# Altium schematic sheet SH27 - EXPANSION1.SchDoc
size 386 x 246 mm
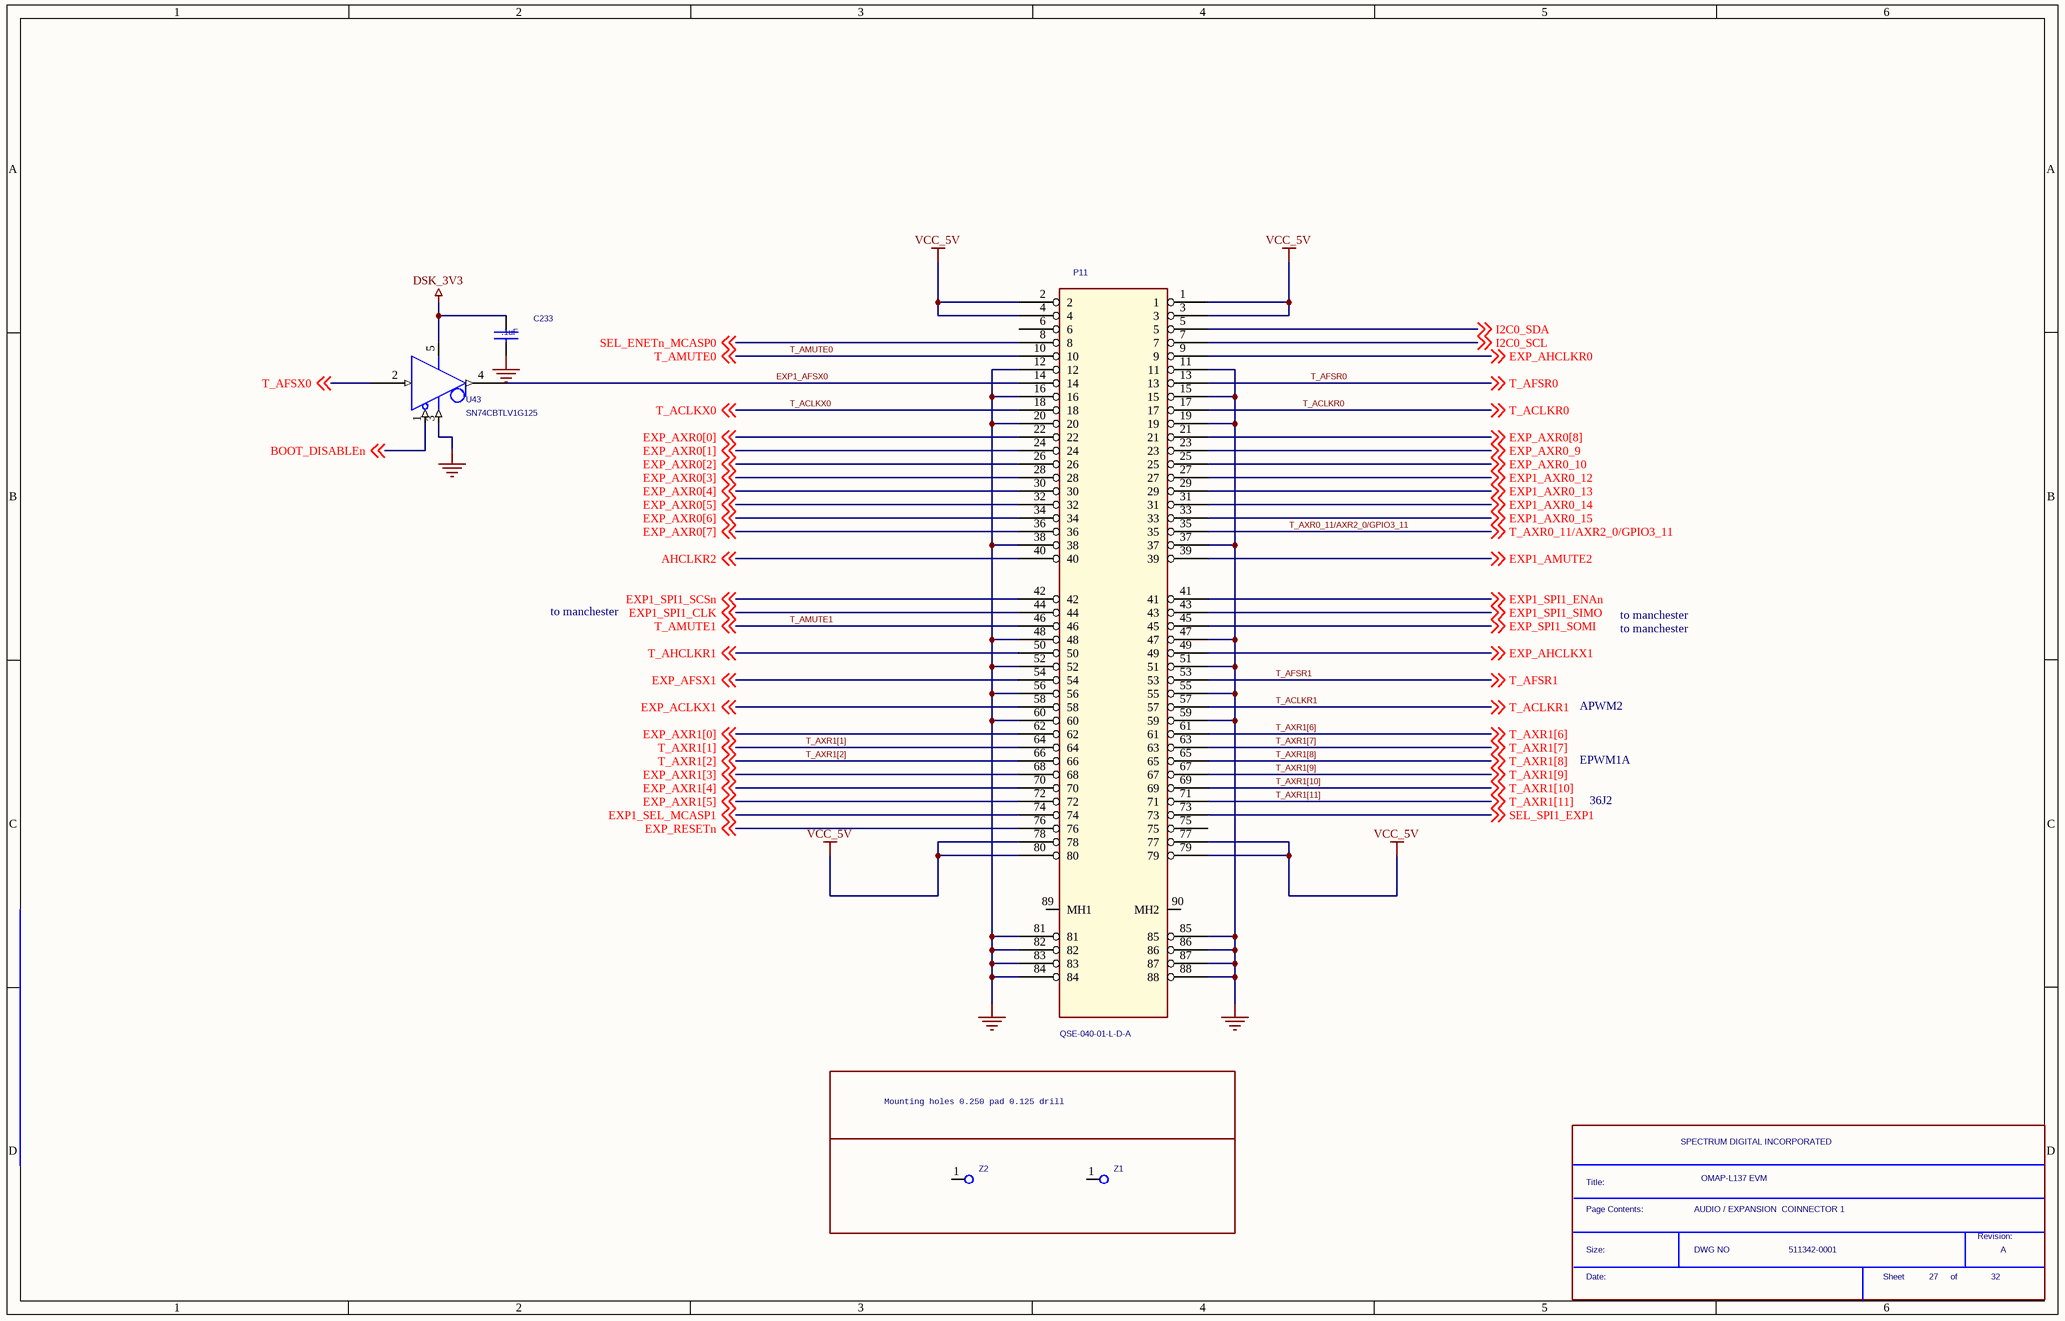
[diagram p0: SH27 - EXPANSION1.SchDoc]

## Parts
*  Page Contents:: AUDIO / EXPANSION  COINNECTOR 1  RevCode: A  Title: OMAP-L137 EVM  OrgName: SPECTRUM DIGITAL INCORPORATED  Doc: 511342-0001  Page Number: 27  Page Count: 32  (hidden comment: SDTitleBlock)  (graphical)
C233  .1uF  [c402-25]
P11  QSE-040-01-L-D-A  [qse_040]
U43  SN74CBTLV1G125  [DCK]
Z1  TestPoint1  [TP1_0-2_0]  (value not drawn)
Z2  MNTHOLE  [TP1_0-2_0]  (value not drawn)

## Blocks framed on the sheet
Mounting holes 0.250 pad 0.125 drill: Z1 Z2

## Nets
DSK_3V3: C233.1 U43.5(VCC)
GND: C233.2 P11.11 P11.12 P11.15 P11.16 P11.19 P11.20 P11.37 P11.38 P11.47 P11.48 P11.51 P11.52 P11.55 P11.56 P11.59 P11.60 P11.81 P11.82 P11.83 P11.84 P11.85 P11.86 P11.87 P11.88 U43.3(GND)
VCC_5V: P11.1 P11.2 P11.3 P11.4 P11.77 P11.78 P11.79 P11.80
AHCLKR2: P11.40 ; off-sheet AHCLKR2
BOOT_DISABLEn: U43.1(OE) ; off-sheet BOOT_DISABLEn
EXP1_AFSX0: P11.14 U43.4(O)
EXP1_AMUTE2: P11.39 ; off-sheet EXP1_AMUTE2
EXP1_AXR0_12: P11.27 ; off-sheet EXP1_AXR0_12
EXP1_AXR0_13: P11.29 ; off-sheet EXP1_AXR0_13
EXP1_AXR0_14: P11.31 ; off-sheet EXP1_AXR0_14
EXP1_AXR0_15: P11.33 ; off-sheet EXP1_AXR0_15
EXP1_SEL_MCASP1: P11.74 ; off-sheet EXP1_SEL_MCASP1
EXP1_SPI1_CLK: P11.44 ; off-sheet EXP1_SPI1_CLK
EXP1_SPI1_ENAn: P11.41 ; off-sheet EXP1_SPI1_ENAn
EXP1_SPI1_SCSn: P11.42 ; off-sheet EXP1_SPI1_SCSn
EXP1_SPI1_SIMO: P11.43 ; off-sheet EXP1_SPI1_SIMO
EXP_ACLKX1: P11.58 ; off-sheet EXP_ACLKX1
EXP_AFSX1: P11.54 ; off-sheet EXP_AFSX1
EXP_AHCLKR0: P11.9 ; off-sheet EXP_AHCLKR0
EXP_AHCLKX1: P11.49 ; off-sheet EXP_AHCLKX1
EXP_AXR0[0]: P11.22 ; off-sheet EXP_AXR0[0]
EXP_AXR0[1]: P11.24 ; off-sheet EXP_AXR0[1]
EXP_AXR0[2]: P11.26 ; off-sheet EXP_AXR0[2]
EXP_AXR0[3]: P11.28 ; off-sheet EXP_AXR0[3]
EXP_AXR0[4]: P11.30 ; off-sheet EXP_AXR0[4]
EXP_AXR0[5]: P11.32 ; off-sheet EXP_AXR0[5]
EXP_AXR0[6]: P11.34 ; off-sheet EXP_AXR0[6]
EXP_AXR0[7]: P11.36 ; off-sheet EXP_AXR0[7]
EXP_AXR0[8]: P11.21 ; off-sheet EXP_AXR0[8]
EXP_AXR0_9: P11.23 ; off-sheet EXP_AXR0_9
EXP_AXR0_10: P11.25 ; off-sheet EXP_AXR0_10
EXP_AXR1[0]: P11.62 ; off-sheet EXP_AXR1[0]
EXP_AXR1[3]: P11.68 ; off-sheet EXP_AXR1[3]
EXP_AXR1[4]: P11.70 ; off-sheet EXP_AXR1[4]
EXP_AXR1[5]: P11.72 ; off-sheet EXP_AXR1[5]
EXP_RESETn: P11.76 ; off-sheet EXP_RESETn
EXP_SPI1_SOMI: P11.45 ; off-sheet EXP_SPI1_SOMI
I2C0_SCL: P11.7 ; off-sheet I2C0_SCL
I2C0_SDA: P11.5 ; off-sheet I2C0_SDA
SEL_ENETn_MCASP0: P11.8 ; off-sheet SEL_ENETn_MCASP0
SEL_SPI1_EXP1: P11.73 ; off-sheet SEL_SPI1_EXP1
T_ACLKR0: P11.17 ; off-sheet T_ACLKR0
T_ACLKR1: P11.57 ; off-sheet T_ACLKR1
T_ACLKX0: P11.18 ; off-sheet T_ACLKX0
T_AFSR0: P11.13 ; off-sheet T_AFSR0
T_AFSR1: P11.53 ; off-sheet T_AFSR1
T_AFSX0: U43.2(I) ; off-sheet T_AFSX0
T_AHCLKR1: P11.50 ; off-sheet T_AHCLKR1
T_AMUTE0: P11.10 ; off-sheet T_AMUTE0
T_AMUTE1: P11.46 ; off-sheet T_AMUTE1
T_AXR0_11/AXR2_0/GPIO3_11: P11.35 ; off-sheet T_AXR0_11/AXR2_0/GPIO3_11
T_AXR1[1]: P11.64 ; off-sheet T_AXR1[1]
T_AXR1[2]: P11.66 ; off-sheet T_AXR1[2]
T_AXR1[6]: P11.61 ; off-sheet T_AXR1[6]
T_AXR1[7]: P11.63 ; off-sheet T_AXR1[7]
T_AXR1[8]: P11.65 ; off-sheet T_AXR1[8]
T_AXR1[9]: P11.67 ; off-sheet T_AXR1[9]
T_AXR1[10]: P11.69 ; off-sheet T_AXR1[10]
T_AXR1[11]: P11.71 ; off-sheet T_AXR1[11]

Not connected (* = marked no-connect by the designer): P11 6 75 89(MH1) 90(MH2); Z1 1; Z2 1

## Notes on the sheet
- to manchester
- APWM2
- EPWM1A
- 36J2
- (in symbol SDTitleBlock) Title:; Page Contents:; Revision:; Size:; DWG NO; Date:; Sheet; of

## Library data of the parts
C233 = CAP NP_2: Part #: 101587-1100R
P11 = QSE-040-01-L-D-A: Part #: 101881-0040R
U43 = SN74LVC1G125: Part #: 101689-0125R
Z1 Z2 = TestPoint1: ATLStockNo1: none